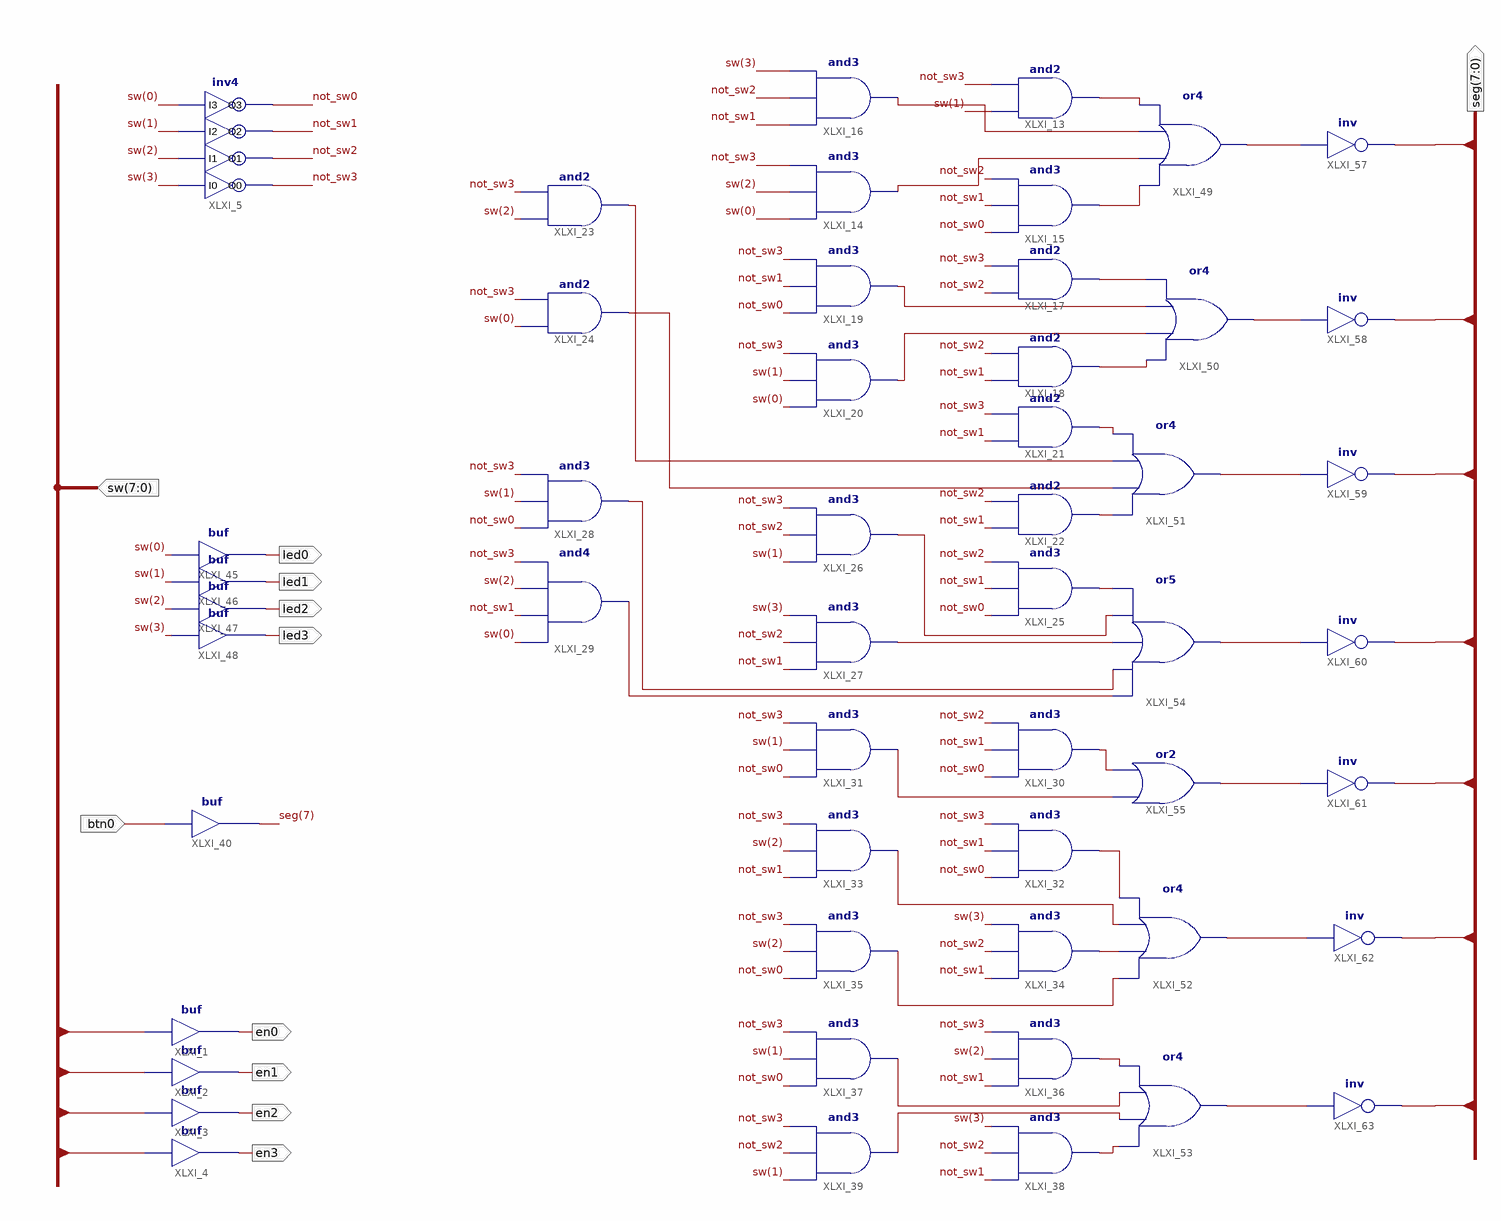
[diagram p0: schematic sheet 1]
// Xilinx ISE schematic Seven_Seg_Driver.sch (spartan3e) as structural Verilog: 51 symbols, 11 ports
module Seven_Seg_Driver (
  input  btn0,
  input  [7:0] sw,
  output en0,
  output en1,
  output en2,
  output en3,
  output led0,
  output led1,
  output led2,
  output led3,
  output [7:0] seg
);

  wire not_sw0, not_sw1, not_sw2, not_sw3, XLXN_52, XLXN_54, XLXN_55, XLXN_98, XLXN_108, XLXN_138, XLXN_139,
       XLXN_140, XLXN_141, XLXN_142, XLXN_164, XLXN_168, XLXN_175, XLXN_176, XLXN_177, XLXN_178, XLXN_191,
       XLXN_192, XLXN_193, XLXN_194, XLXN_196, XLXN_198, XLXN_199, XLXN_202, XLXN_203, XLXN_204, XLXN_205,
       XLXN_255, XLXN_258, XLXN_259, XLXN_260, XLXN_261, XLXN_262, XLXN_263;

  buf XLXI_1 (en0, sw[4]);
  buf XLXI_2 (en1, sw[5]);
  buf XLXI_3 (en2, sw[6]);
  buf XLXI_4 (en3, sw[7]);
  inv4 XLXI_5 (.I0(sw[3]), .I1(sw[2]), .I2(sw[1]), .I3(sw[0]), .O0(not_sw3), .O1(not_sw2), .O2(not_sw1), .O3(not_sw0));
  and XLXI_13 (XLXN_52, sw[1], not_sw3);
  and XLXI_16 (XLXN_54, not_sw1, not_sw2, sw[3]);
  and XLXI_14 (XLXN_55, sw[0], sw[2], not_sw3);
  and XLXI_15 (XLXN_98, not_sw0, not_sw1, not_sw2);
  and XLXI_18 (XLXN_199, not_sw1, not_sw2);
  and XLXI_19 (XLXN_196, not_sw0, not_sw1, not_sw3);
  and XLXI_20 (XLXN_198, sw[0], sw[1], not_sw3);
  and XLXI_17 (XLXN_108, not_sw2, not_sw3);
  and XLXI_22 (XLXN_205, not_sw1, not_sw2);
  and XLXI_23 (XLXN_203, sw[2], not_sw3);
  and XLXI_24 (XLXN_204, sw[0], not_sw3);
  and XLXI_21 (XLXN_202, not_sw1, not_sw3);
  and XLXI_25 (XLXN_139, not_sw0, not_sw1, not_sw2);
  and XLXI_26 (XLXN_138, sw[1], not_sw2, not_sw3);
  and XLXI_27 (XLXN_140, not_sw1, not_sw2, sw[3]);
  and XLXI_28 (XLXN_141, not_sw0, sw[1], not_sw3);
  and XLXI_29 (XLXN_142, sw[0], not_sw1, sw[2], not_sw3);
  and XLXI_31 (XLXN_168, not_sw0, sw[1], not_sw3);
  and XLXI_30 (XLXN_164, not_sw0, not_sw1, not_sw2);
  and XLXI_32 (XLXN_175, not_sw0, not_sw1, not_sw3);
  and XLXI_33 (XLXN_176, not_sw1, sw[2], not_sw3);
  and XLXI_34 (XLXN_177, not_sw1, not_sw2, sw[3]);
  and XLXI_35 (XLXN_178, not_sw0, sw[2], not_sw3);
  and XLXI_36 (XLXN_191, not_sw1, sw[2], not_sw3);
  and XLXI_37 (XLXN_192, not_sw0, sw[1], not_sw3);
  and XLXI_38 (XLXN_194, not_sw1, not_sw2, sw[3]);
  and XLXI_39 (XLXN_193, sw[1], not_sw2, not_sw3);
  buf XLXI_40 (seg[7], btn0);
  buf XLXI_45 (led0, sw[0]);
  buf XLXI_46 (led1, sw[1]);
  buf XLXI_47 (led2, sw[2]);
  buf XLXI_48 (led3, sw[3]);
  or XLXI_49 (XLXN_255, XLXN_98, XLXN_55, XLXN_54, XLXN_52);
  or XLXI_50 (XLXN_263, XLXN_199, XLXN_198, XLXN_196, XLXN_108);
  or XLXI_51 (XLXN_262, XLXN_205, XLXN_204, XLXN_203, XLXN_202);
  or XLXI_52 (XLXN_259, XLXN_178, XLXN_177, XLXN_176, XLXN_175);
  or XLXI_53 (XLXN_258, XLXN_194, XLXN_193, XLXN_192, XLXN_191);
  or XLXI_54 (XLXN_261, XLXN_142, XLXN_141, XLXN_140, XLXN_138, XLXN_139);
  or XLXI_55 (XLXN_260, XLXN_168, XLXN_164);
  not XLXI_57 (seg[0], XLXN_255);
  not XLXI_58 (seg[1], XLXN_263);
  not XLXI_59 (seg[2], XLXN_262);
  not XLXI_60 (seg[3], XLXN_261);
  not XLXI_61 (seg[4], XLXN_260);
  not XLXI_62 (seg[5], XLXN_259);
  not XLXI_63 (seg[6], XLXN_258);
endmodule
